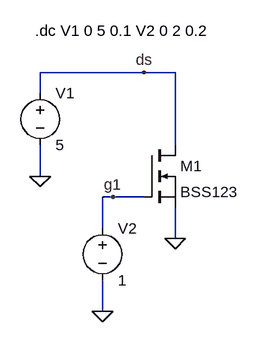
[diagram p0: schematic Vds_id.asc]
Vds_id.asc, the LTspice schematic file:
Version 4
SHEET 1 880 680
WIRE 192 0 32 0
WIRE 240 0 192 0
WIRE 32 32 32 0
WIRE 240 112 240 0
WIRE 32 160 32 112
WIRE 144 192 128 192
WIRE 192 192 144 192
WIRE 128 240 128 192
WIRE 240 256 240 208
WIRE 128 368 128 320
FLAG 240 256 0
FLAG 128 368 0
FLAG 32 160 0
FLAG 144 192 g1
FLAG 192 0 ds
SYMBOL nmos 192 112 R0
SYMATTR InstName M1
SYMATTR Value BSS123
SYMBOL voltage 128 224 R0
SYMATTR InstName V2
SYMATTR Value 1
SYMBOL voltage 32 16 R0
SYMATTR InstName V1
SYMATTR Value 5
TEXT 24 -64 Left 0 !.dc V1 0 5 0.1 V2 0 2 0.2

The netlist it stands for:
* Vds_id.asc
M1 ds g1 0 0 BSS123
V2 g1 0 1
V1 ds 0 5
.model NMOS NMOS
.model PMOS PMOS
.lib standard.mos
.dc V1 0 5 0.1 V2 0 2 0.2
.backanno
.end